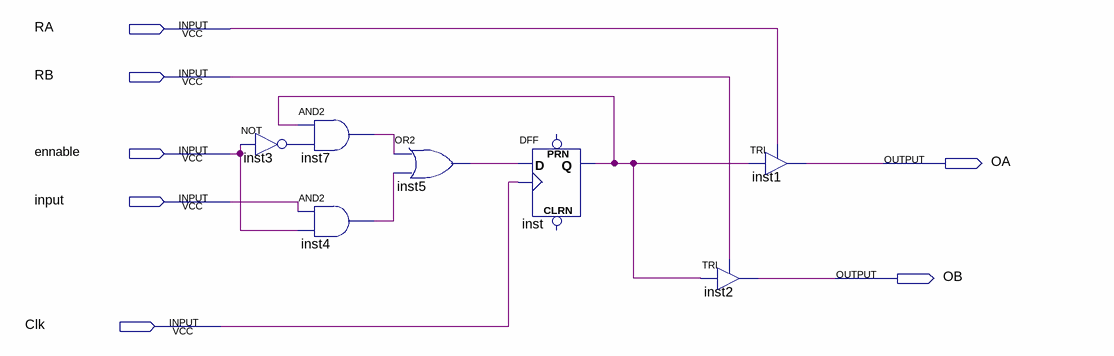
[diagram p0: schematic sheet]
// Quartus schematic Reg1bit.bdf as structural Verilog: 7 symbols, 7 pins
module Reg1bit (
  input  RA,
  input  RB,
  input  ennable,
  input  \input ,
  input  Clk,
  output OA,
  output OB
);

  wire inst3_out, inst4_out, inst5_out, inst7_out, inst_q;

  not inst3 (inst3_out, ennable);
  and inst7 (inst7_out, inst_q, inst3_out);
  and inst4 (inst4_out, \input , ennable);
  or inst5 (inst5_out, inst7_out, inst4_out);
  DFF inst (.CLK(Clk), .D(inst5_out), .Q(inst_q));  // open: CLRN, PRN
  TRI inst2 (.IN(inst_q), .OE(RB), .OUT(OB));
  TRI inst1 (.IN(inst_q), .OE(RA), .OUT(OA));
endmodule
